# EAGLE design Esquematico (EAGLE 9.6.2)
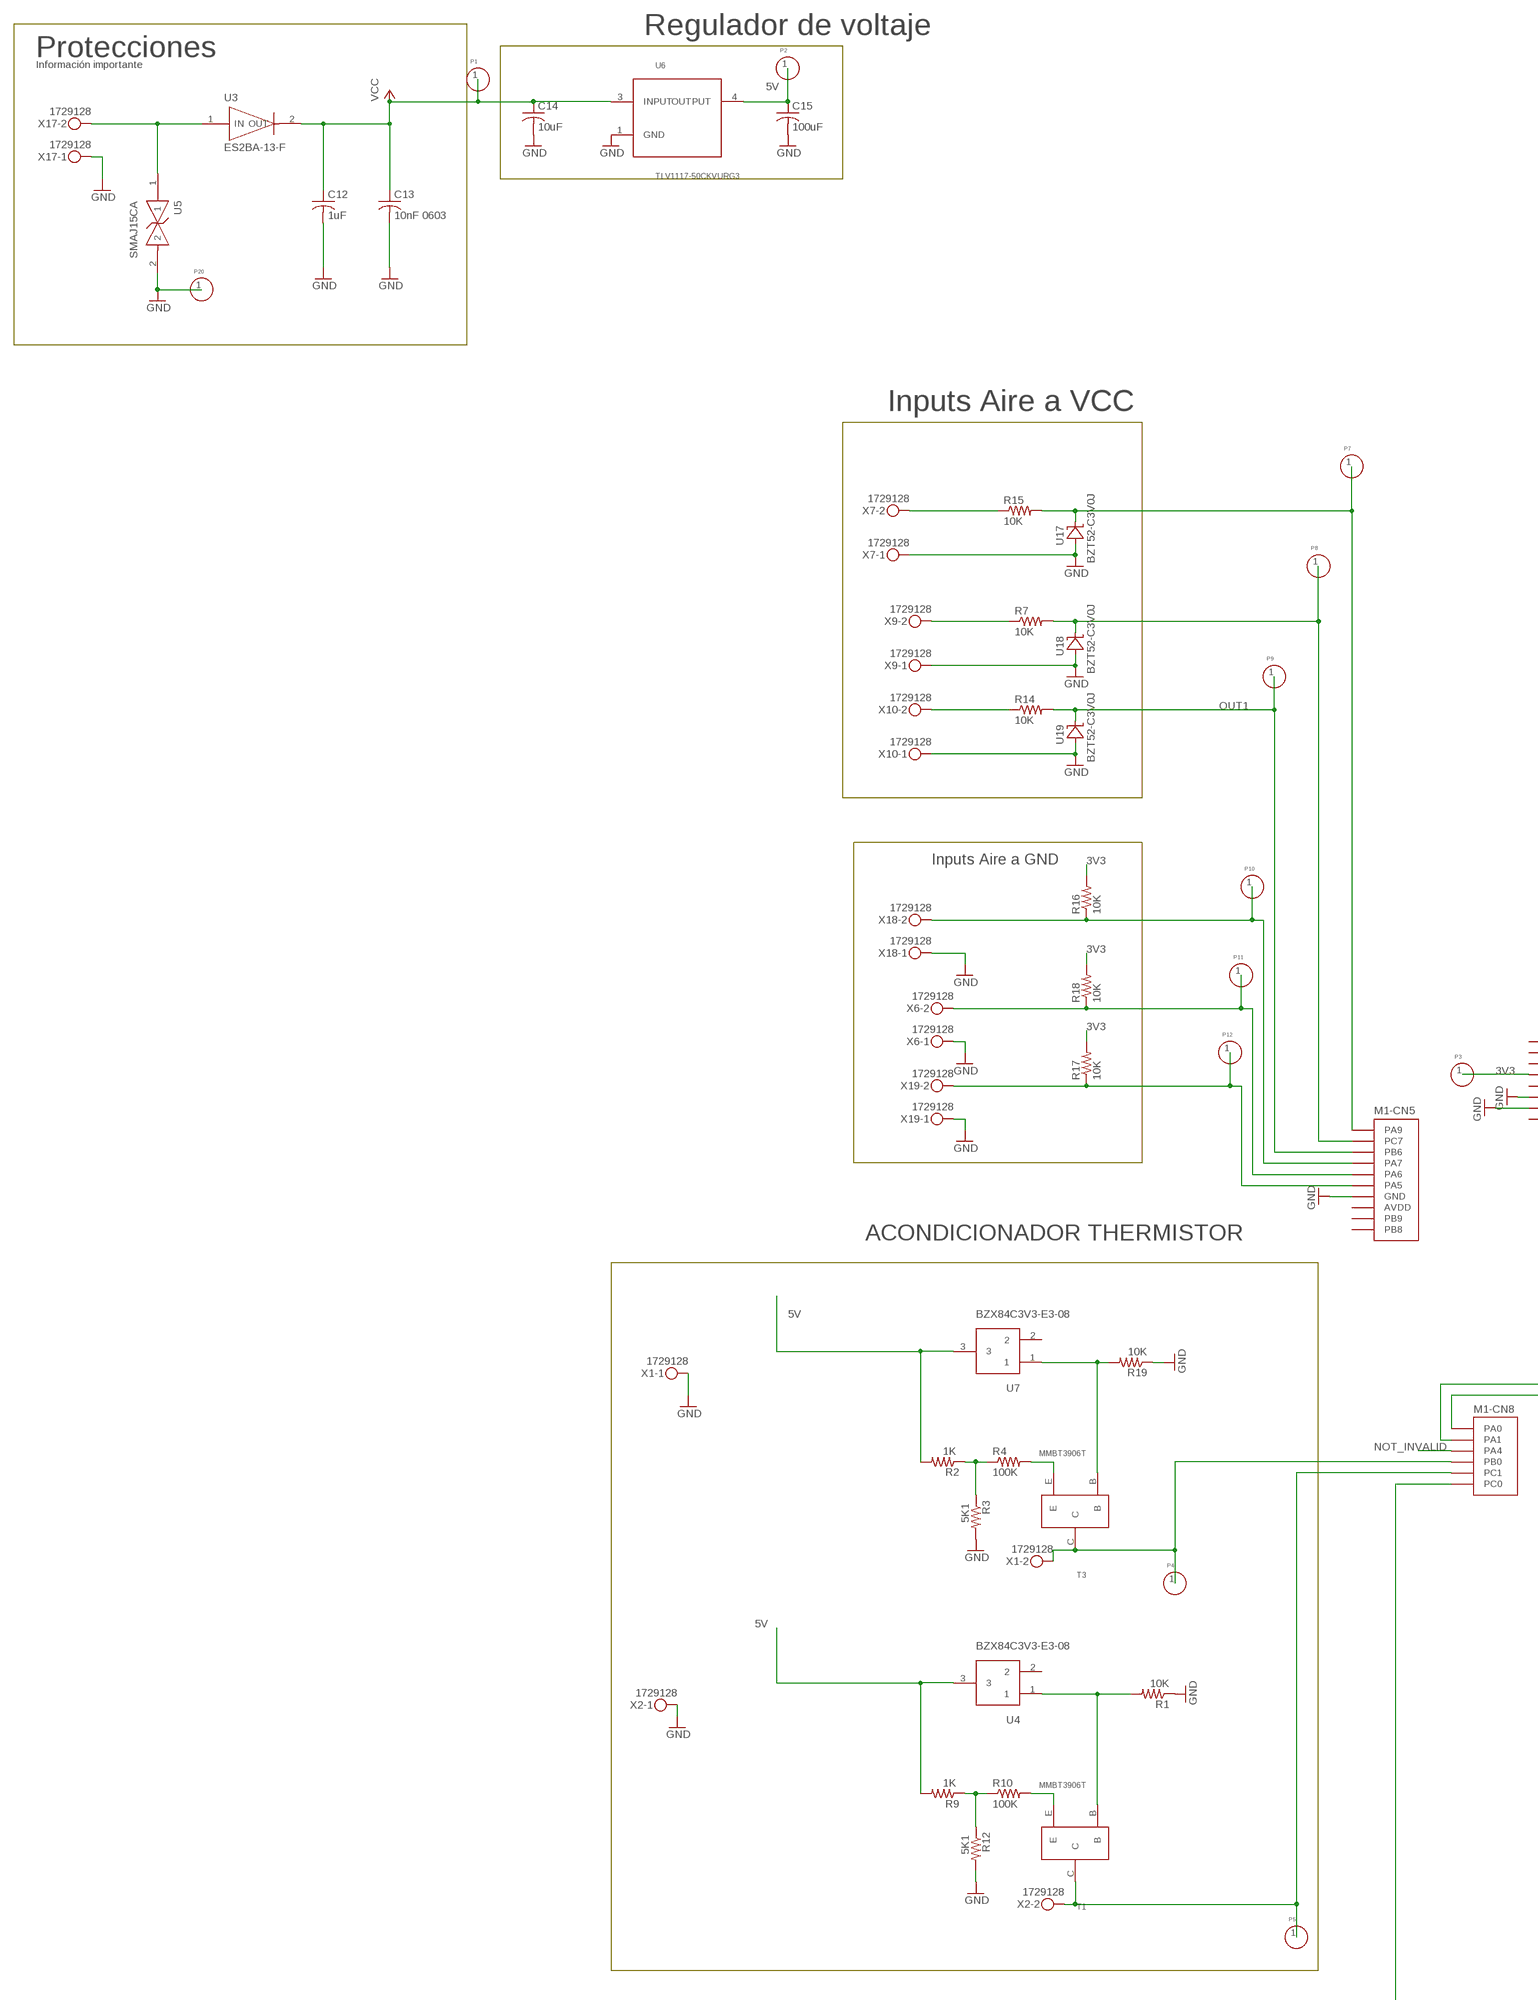
[diagram p0: schematic, sheet 1, part 1 of 3]
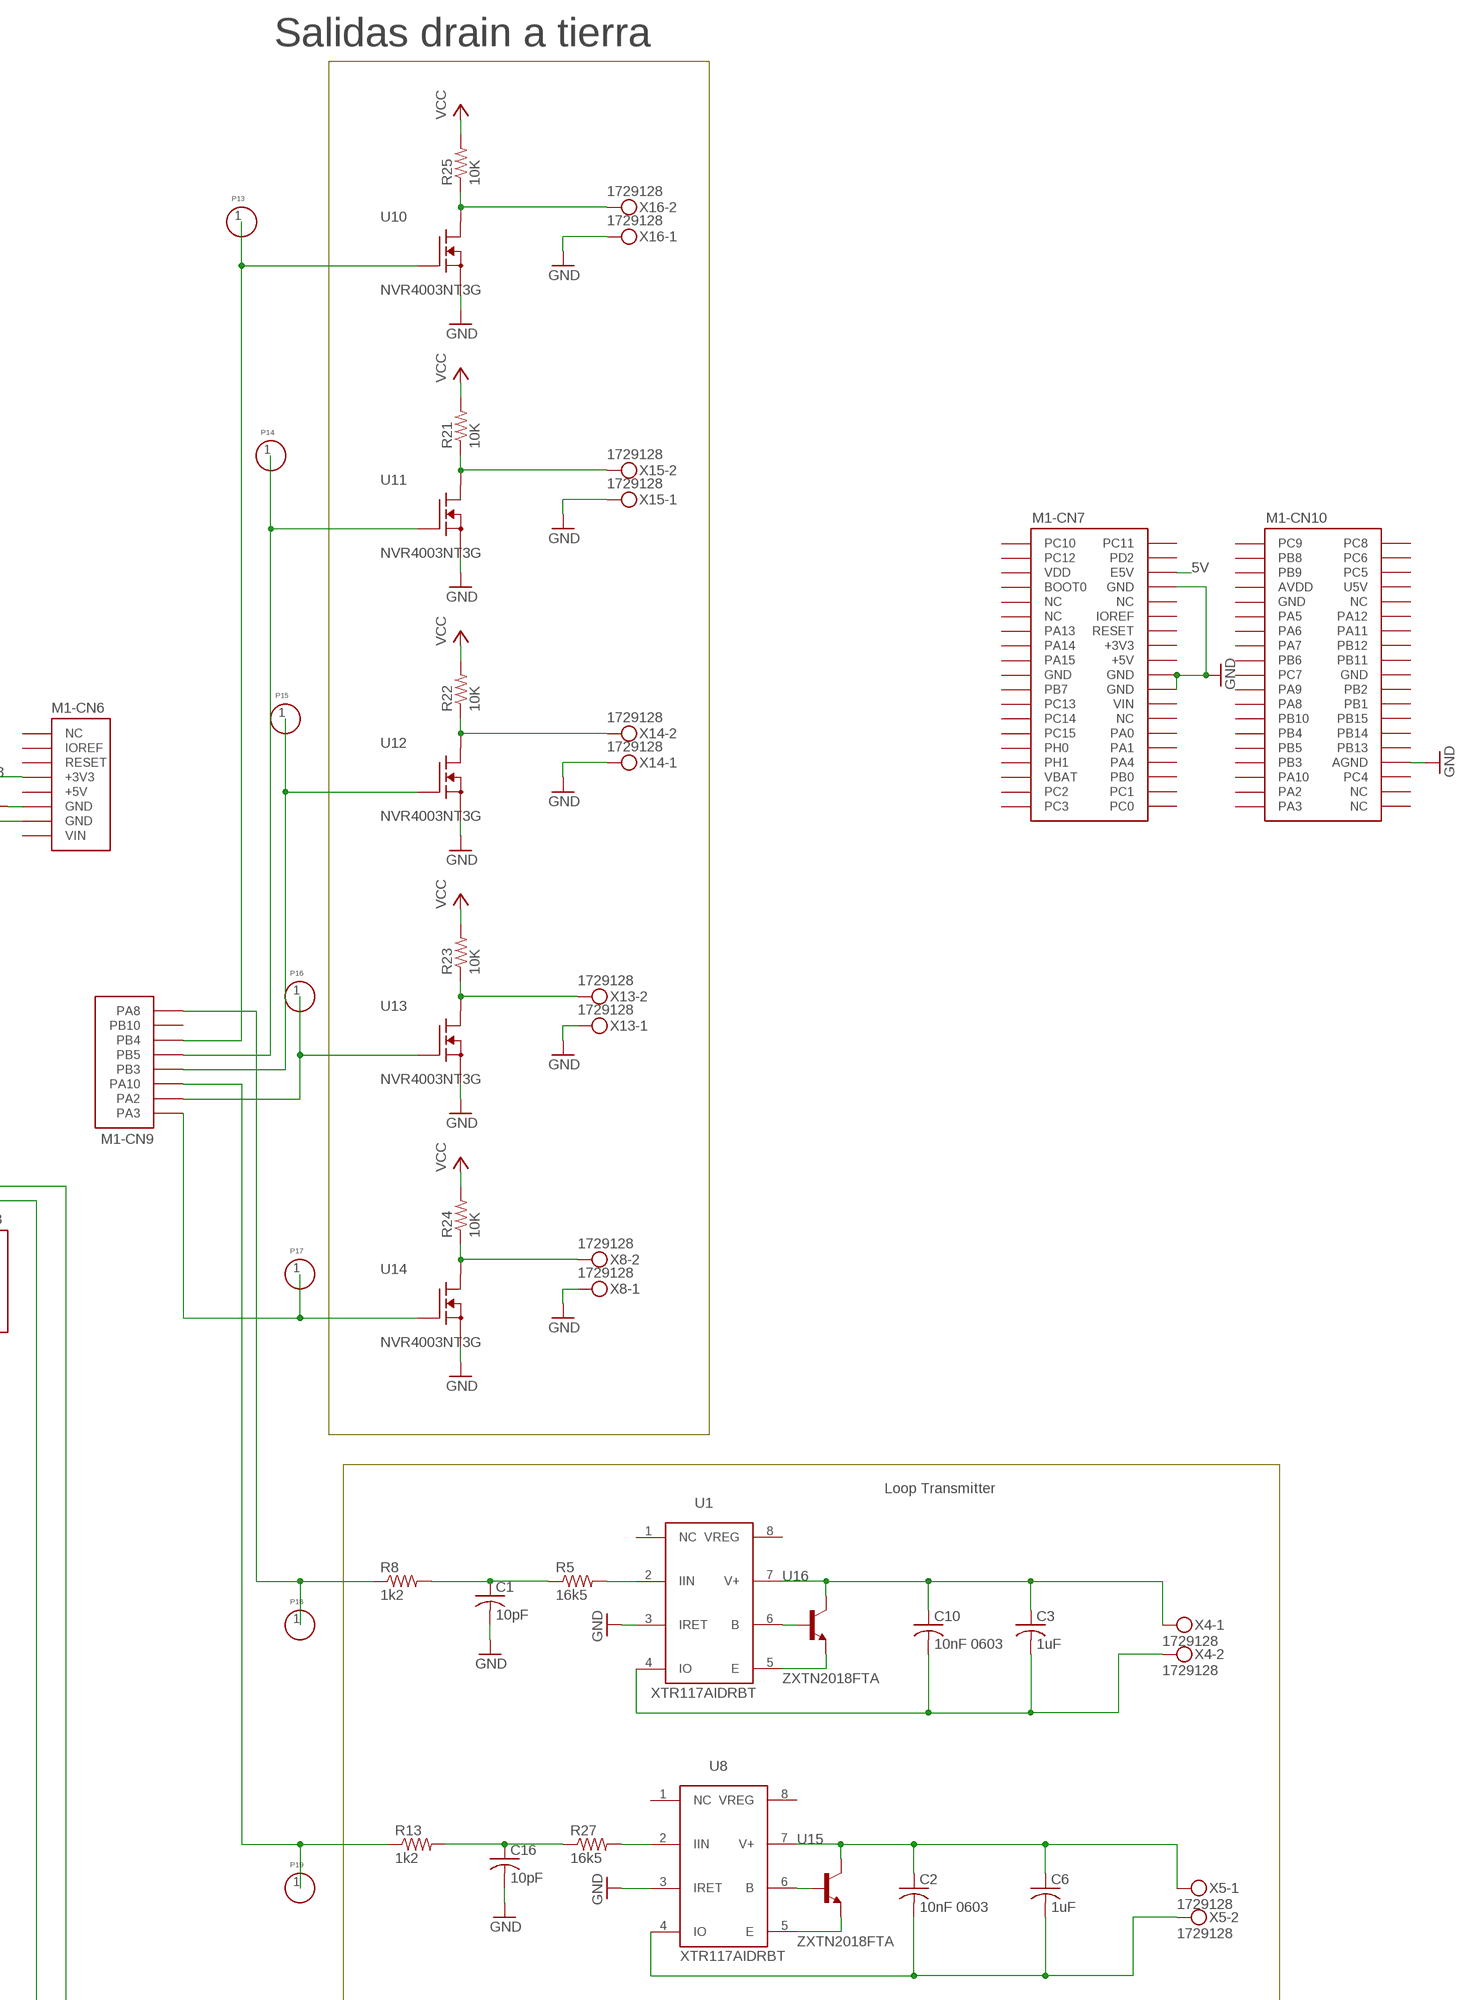
[diagram p1: schematic, sheet 1, part 2 of 3]
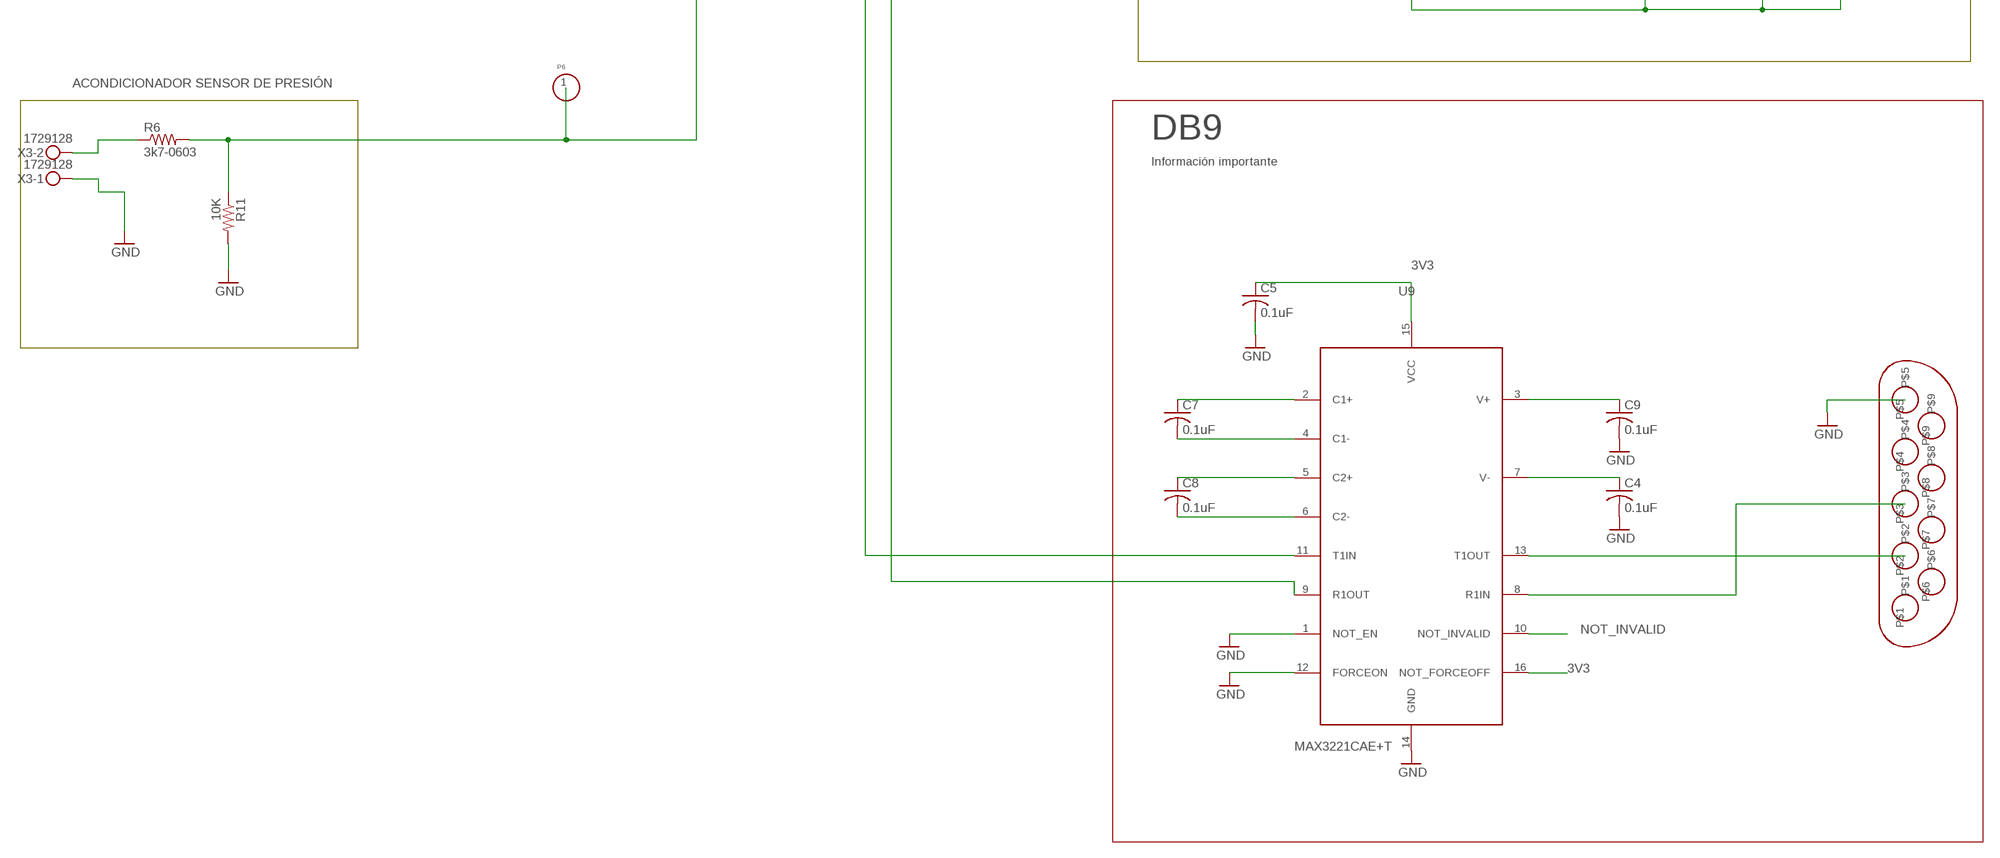
[diagram p2: schematic, sheet 1, part 3 of 3]

## Parts
C1  10pF  C-USC0805  [C0805]
C2  10nF 0603  C-USC0603  [C0603]
C3  1uF  C-USC0805  [C0805]
C4  0.1uF  C-USC0805  [C0805]
C5  0.1uF  C-USC0805  [C0805]
C6  1uF  C-USC0805  [C0805]
C7  0.1uF  C-USC0805  [C0805]
C8  0.1uF  C-USC0805  [C0805]
C9  0.1uF  C-USC0805  [C0805]
C10  10nF 0603  C-USC0603  [C0603]
C12  1uF  C-USC0805  [C0805]
C13  10nF 0603  C-USC0603  [C0603]
C14  10uF  C-USC0805  [C0805]
C15  100uF  C-USC0805  [C0805]
C16  10pF  C-USC0805  [C0805]
M1  NUCLEO-L452RE  [NUCLEO-64]
P1  TESTPOINT  [TESTPOINT]
P2  TESTPOINT  [TESTPOINT]
P3  TESTPOINT  [TESTPOINT]
P4  TESTPOINT  [TESTPOINT]
P5  TESTPOINT  [TESTPOINT]
P6  TESTPOINT  [TESTPOINT]
P7  TESTPOINT  [TESTPOINT]
P8  TESTPOINT  [TESTPOINT]
P9  TESTPOINT  [TESTPOINT]
P10  TESTPOINT  [TESTPOINT]
P11  TESTPOINT  [TESTPOINT]
P12  TESTPOINT  [TESTPOINT]
P13  TESTPOINT  [TESTPOINT]
P14  TESTPOINT  [TESTPOINT]
P15  TESTPOINT  [TESTPOINT]
P16  TESTPOINT  [TESTPOINT]
P17  TESTPOINT  [TESTPOINT]
P18  TESTPOINT  [TESTPOINT]
P19  TESTPOINT  [TESTPOINT]
P20  TESTPOINT  [TESTPOINT]
R1  10K  R-US_R0805  [R0805]
R2  1K  R-US_R0805  [R0805]
R3  5K1  R-US_R0805  [R0805]
R4  100K  R-US_R0805  [R0805]
R5  16k5  R-US_R0805  [R0805]
R6  3k7-0603  R-US_R0603  [R0603]
R7  10K  R-US_R0805  [R0805]
R8  1k2  R-US_R0805  [R0805]
R9  1K  R-US_R0805  [R0805]
R10  100K  R-US_R0805  [R0805]
R11  10K  R-US_R0805  [R0805]
R12  5K1  R-US_R0805  [R0805]
R13  1k2  R-US_R0805  [R0805]
R14  10K  R-US_R0805  [R0805]
R15  10K  R-US_R0805  [R0805]
R16  10K  R-US_R0805  [R0805]
R17  10K  R-US_R0805  [R0805]
R18  10K  R-US_R0805  [R0805]
R19  10K  R-US_R0805  [R0805]
R21  10K  R-US_R0805  [R0805]
R22  10K  R-US_R0805  [R0805]
R23  10K  R-US_R0805  [R0805]
R24  10K  R-US_R0805  [R0805]
R25  10K  R-US_R0805  [R0805]
R27  16k5  R-US_R0805  [R0805]
T1  MMBT3906T  [SOT-523]
T3  MMBT3906T  [SOT-523]
U1  XTR117AIDRBT  XTR117AIDRBT-TI  [8-SON]
U2  D09P33E4GX00LF  [JEDEC]
U3  ES2BA-13-F  [SMA]
U4  BZX84C3V3-E3-08  BZX84C3V3-E3-08_VISHAY  [SOT-23-3]
U5  SMAJ15CA  [DO-214AC(SMA)]
U6  TLV1117-50CKVURG3  [KVU(TO-252)]
U7  BZX84C3V3-E3-08  BZX84C3V3-E3-08_VISHAY  [SOT-23-3]
U8  XTR117AIDRBT  XTR117AIDRBT-TI  [8-SON]
U9  MAX3221CAE+T  MAX3221CAE+T-AD  [16-SSOP]
U10  NVR4003NT3G  NVR4003NT3-ONSEMI  [SOT-23-3]
U11  NVR4003NT3G  NVR4003NT3-ONSEMI  [SOT-23-3]
U12  NVR4003NT3G  NVR4003NT3-ONSEMI  [SOT-23-3]
U13  NVR4003NT3G  NVR4003NT3-ONSEMI  [SOT-23-3]
U14  NVR4003NT3G  NVR4003NT3-ONSEMI  [SOT-23-3]
U15  ZXTN2018FTA  [SOT23-EBC]
U16  ZXTN2018FTA  [SOT23-EBC]
U17  BZT52-C3V0J  BZT52-C3V0J-NEXPERIA  [BZT52-C3V0J-NEXPERIA]
U18  BZT52-C3V0J  BZT52-C3V0J-NEXPERIA  [BZT52-C3V0J-NEXPERIA]
U19  BZT52-C3V0J  BZT52-C3V0J-NEXPERIA  [BZT52-C3V0J-NEXPERIA]
X1  1729128  MKDSN1,5/2-5,08  [MKDSN1,5/2-5,08]
X2  1729128  MKDSN1,5/2-5,08  [MKDSN1,5/2-5,08]
X3  1729128  MKDSN1,5/2-5,08  [MKDSN1,5/2-5,08]
X4  1729128  MKDSN1,5/2-5,08  [MKDSN1,5/2-5,08]
X5  1729128  MKDSN1,5/2-5,08  [MKDSN1,5/2-5,08]
X6  1729128  MKDSN1,5/2-5,08  [MKDSN1,5/2-5,08]
X7  1729128  MKDSN1,5/2-5,08  [MKDSN1,5/2-5,08]
X8  1729128  MKDSN1,5/2-5,08  [MKDSN1,5/2-5,08]
X9  1729128  MKDSN1,5/2-5,08  [MKDSN1,5/2-5,08]
X10  1729128  MKDSN1,5/2-5,08  [MKDSN1,5/2-5,08]
X13  1729128  MKDSN1,5/2-5,08  [MKDSN1,5/2-5,08]
X14  1729128  MKDSN1,5/2-5,08  [MKDSN1,5/2-5,08]
X15  1729128  MKDSN1,5/2-5,08  [MKDSN1,5/2-5,08]
X16  1729128  MKDSN1,5/2-5,08  [MKDSN1,5/2-5,08]
X17  1729128  MKDSN1,5/2-5,08  [MKDSN1,5/2-5,08]
X18  1729128  MKDSN1,5/2-5,08  [MKDSN1,5/2-5,08]
X19  1729128  MKDSN1,5/2-5,08  [MKDSN1,5/2-5,08]

## Nets
3V3: C5.1 M1.CN6-4(-CN6:+3V3) P3.1 R16.2 R17.2 R18.2 U9.15(VCC) U9.16(NOT_FORCEOFF)
5V: C15.1 M1.CN7-6(-CN7:E5V) P2.1 R2.2 R9.2 U4.3 U6.4(OUTPUT) U7.3
GND: C1.2 C4.2 C5.2 C9.2 C12.2 C13.2 C14.2 C15.2 C16.2 M1.CN5-7(-CN5:GND) M1.CN6-6(-CN6:GND) M1.CN6-7(-CN6:GND) M1.CN7-19(-CN7:GND) M1.CN7-20(-CN7:GND) M1.CN7-22(-CN7:GND) M1.CN10-32(-CN10:AGND) P20.1 R1.1 R3.2 R11.2 R12.2 R19.1 U1.3(IRET) U2.P$5 U5.2 U6.1(GND) U8.3(IRET) U9.1(NOT_EN) U9.12(FORCEON) U9.14(GND) U10.2(SOURCE) U11.2(SOURCE) U12.2(SOURCE) U13.2(SOURCE) U14.2(SOURCE) U17.1(ANODE) U18.1(ANODE) U19.1(ANODE) X1.1 X2.1 X3.1 X6.1 X7.1 X8.1 X9.1 X10.1 X13.1 X14.1 X15.1 X16.1 X17.1 X18.1 X19.1
N$1: R19.2 T3.B U7.1
N$2: R2.1 R3.1 R4.1
N$3: R4.2 T3.E
N$4: M1.CN9-8(-CN9:PA8) P18.1 R8.1
N$5: M1.CN8-6(-CN8:PC0) P6.1 R6.2 R11.1
N$6: R6.1 X3.2
N$7: C1.1 R5.1 R8.2
N$8: R5.2 U1.2(IIN)
N$10: C16.1 R13.2 R27.1
N$11: C3.2 C10.2 U1.4(IO) X4.2
N$12: U1.6(B) U16.B
N$13: U1.5(E) U16.E
N$14: R1.2 T1.B U4.1
N$15: R9.1 R10.1 R12.1
N$16: R10.2 T1.E
N$17: M1.CN8-5(-CN8:PC1) P5.1 T1.C X2.2
N$18: C3.1 C10.1 U1.7(V+) U16.C X4.1
N$19: R27.2 U8.2(IIN)
N$21: C2.2 C6.2 U8.4(IO) X5.2
N$22: U8.6(B) U15.B
N$23: U8.5(E) U15.E
N$24: C2.1 C6.1 U8.7(V+) U15.C X5.1
N$25: R15.1 X7.2
N$26: M1.CN5-1(-CN5:PA9) P7.1 R15.2 U17.2(CATODE)
N$27: M1.CN5-4(-CN5:PA7) P10.1 R16.1 X18.2
N$28: R7.1 X9.2
N$29: M1.CN5-2(-CN5:PC7) P8.1 R7.2 U18.2(CATODE)
N$30: R14.1 X10.2
N$32: M1.CN5-5(-CN5:PA6) P11.1 R18.1 X6.2
N$33: M1.CN5-6(-CN5:PA5) P12.1 R17.1 X19.2
N$34: R21.1 U11.3(DRAIN) X15.2
N$35: M1.CN9-5(-CN9:PB5) P14.1 U11.1(GATE)
N$36: R22.1 U12.3(DRAIN) X14.2
N$37: M1.CN9-4(-CN9:PB3) P15.1 U12.1(GATE)
N$38: R23.1 U13.3(DRAIN) X13.2
N$39: M1.CN9-2(-CN9:PA2) P16.1 U13.1(GATE)
N$40: R24.1 U14.3(DRAIN) X8.2
N$41: M1.CN9-1(-CN9:PA3) P17.1 U14.1(GATE)
N$42: R25.1 U10.3(DRAIN) X16.2
N$43: M1.CN9-6(-CN9:PB4) P13.1 U10.1(GATE)
N$44: M1.CN9-3(-CN9:PA10) P19.1 R13.1
N$45: M1.CN8-4(-CN8:PB0) P4.1 T3.C X1.2
N$46: C4.1 U9.7(V-)
N$47: C9.1 U9.3(V+)
N$48: C7.1 U9.2(C1+)
N$49: C7.2 U9.4(C1-)
N$50: C8.1 U9.5(C2+)
N$51: C8.2 U9.6(C2-)
N$52: U2.P$2 U9.13(T1OUT)
N$53: U2.P$3 U9.8(R1IN)
N$56: U3.1(IN) U5.1 X17.2
N$57: M1.CN8-1(-CN8:PA0) U9.11(T1IN)
N$58: M1.CN8-2(-CN8:PA1) U9.9(R1OUT)
NOT_INVALID: M1.CN8-3(-CN8:PA4) U9.10(NOT_INVALID)
OUT1: M1.CN5-3(-CN5:PB6) P9.1 R14.2 U19.2(CATODE)
VCC: C12.1 C13.1 C14.1 P1.1 R21.2 R22.2 R23.2 R24.2 R25.2 U3.2(OUT) U6.3(INPUT)
Unconnected: M1.CN5-9(-CN5:PB9) M1.CN5-10(-CN5:PB8) M1.CN6-1(-CN6:NC) M1.CN6-3(-CN6:RESET) M1.CN7-1(-CN7:PC10) M1.CN7-2(-CN7:PC11) M1.CN7-3(-CN7:PC12) M1.CN7-4(-CN7:PD2) M1.CN7-7(-CN7:BOOT0) M1.CN7-9(-CN7:NC) M1.CN7-10(-CN7:NC) M1.CN7-11(-CN7:NC) M1.CN7-12(-CN7:IOREF) M1.CN7-13(-CN7:PA13) M1.CN7-14(-CN7:RESET) M1.CN7-15(-CN7:PA14) M1.CN7-17(-CN7:PA15) M1.CN7-21(-CN7:PB7) M1.CN7-23(-CN7:PC13) M1.CN7-25(-CN7:PC14) M1.CN7-26(-CN7:NC) M1.CN7-27(-CN7:PC15) M1.CN7-28(-CN7:PA0) M1.CN7-29(-CN7:PH0) M1.CN7-30(-CN7:PA1) M1.CN7-31(-CN7:PH1) M1.CN7-32(-CN7:PA4) M1.CN7-34(-CN7:PB0) M1.CN7-35(-CN7:PC2) M1.CN7-36(-CN7:PC1) M1.CN7-37(-CN7:PC3) M1.CN7-38(-CN7:PC0) M1.CN9-7(-CN9:PB10) M1.CN10-1(-CN10:PC9) M1.CN10-2(-CN10:PC8) M1.CN10-3(-CN10:PB8) M1.CN10-4(-CN10:PC6) M1.CN10-5(-CN10:PB9) M1.CN10-6(-CN10:PC5) M1.CN10-10(-CN10:NC) M1.CN10-11(-CN10:PA5) M1.CN10-12(-CN10:PA12) M1.CN10-13(-CN10:PA6) M1.CN10-14(-CN10:PA11) M1.CN10-15(-CN10:PA7) M1.CN10-16(-CN10:PB12) M1.CN10-17(-CN10:PB6) M1.CN10-18(-CN10:PB11) M1.CN10-19(-CN10:PC7) M1.CN10-21(-CN10:PA9) M1.CN10-22(-CN10:PB2) M1.CN10-23(-CN10:PA8) M1.CN10-24(-CN10:PB1) M1.CN10-25(-CN10:PB10) M1.CN10-26(-CN10:PB15) M1.CN10-27(-CN10:PB4) M1.CN10-28(-CN10:PB14) M1.CN10-29(-CN10:PB5) M1.CN10-30(-CN10:PB13) M1.CN10-31(-CN10:PB3) M1.CN10-33(-CN10:PA10) M1.CN10-34(-CN10:PC4) M1.CN10-35(-CN10:PA2) M1.CN10-36(-CN10:NC) M1.CN10-37(-CN10:PA3) M1.CN10-38(-CN10:NC) U1.1(NC) U1.8(VREG) U2.P$1 U2.P$4 U2.P$6 U2.P$7 U2.P$8 U2.P$9 U4.2 U7.2 U8.1(NC) U8.8(VREG)

## Notes on the sheet
- Regulador de voltaje
- Protecciones
- Información importante
- Inputs Aire a VCC
- Salidas drain a tierra
- Inputs Aire a GND
- ACONDICIONADOR THERMISTOR
- Loop Transmitter
- ACONDICIONADOR SENSOR DE PRESIÓN
- DB9
- Información importante

## Power pins joined to a net without a drawn wire
+3V3: M1.CN7-16(-CN7:+3V3)
+5V: M1.CN6-5(-CN6:+5V) M1.CN7-18(-CN7:+5V)
AVDD: M1.CN5-8(-CN5:AVDD) M1.CN10-7(-CN10:AVDD)
GND: M1.CN7-8(-CN7:GND) M1.CN10-9(-CN10:GND) M1.CN10-20(-CN10:GND)
IOREF: M1.CN6-2(-CN6:IOREF)
U5V: M1.CN10-8(-CN10:U5V)
VBAT: M1.CN7-33(-CN7:VBAT)
VDD: M1.CN7-5(-CN7:VDD)
VIN: M1.CN6-8(-CN6:VIN) M1.CN7-24(-CN7:VIN)

## Library data of the parts
C1 C16 = rcl:C-US: CAPACITOR, American symbol; PARTNO: 0805D100J101KHT; SPICEPREFIX: C
C2 C10 C13 = rcl:C-US: CAPACITOR, American symbol; PARTNO: GCM188R72A103KA37D; SPICEPREFIX: C
C3 C6 C12 = rcl:C-US: CAPACITOR, American symbol; PARTNO: GCM21BR71E105KA56L; SPICEPREFIX: C
C4 C5 C7-C9 = rcl:C-US: CAPACITOR, American symbol; PARTNO: GCM21BR72A104KA37L; SPICEPREFIX: C
C14 = rcl:C-US: CAPACITOR, American symbol; PARTNO: TCTPL1C106M8R; SPICEPREFIX: C
C15 = rcl:C-US: CAPACITOR, American symbol; PARTNO: TLJP107M006R5400; SPICEPREFIX: C
M1 = NUCLEO-L452RE:NUCLEO-L452RE: No existe un outline (Layer Dimension) para esta librería. En su lugar se utilizó una referencia en tDocu. Al momento de diseñar la tarjeta, el Dimension debe ser dibujado según los requerimientos del usuario, o simplemente copiar los contenidos del tDocu en Dimensions.; PARTNO: NUCLEO-L452RE
P1-P20 = TESTPOINT:TESTPOINT
R1 R7 R11 R14-R19 R21-R25 = rcl:R-US_: RESISTOR, American symbol; PARTNO: RK73G2ATTD1002F; SPICEPREFIX: R
R2 R9 = rcl:R-US_: RESISTOR, American symbol; PARTNO: AC0805FR-101KL; SPICEPREFIX: R
R3 R12 = rcl:R-US_: RESISTOR, American symbol; PARTNO: ESR10EZPJ512; SPICEPREFIX: R
R4 R10 = rcl:R-US_: RESISTOR, American symbol; PARTNO: AT0805FRE07100KL; SPICEPREFIX: R
R5 R27 = rcl:R-US_: RESISTOR, American symbol; PARTNO: ERJ-PB6B1652V; SPICEPREFIX: R
R6 = rcl:R-US_: RESISTOR, American symbol; PARTNO: RN73H1JTTD3701B25; SPICEPREFIX: R
R8 R13 = rcl:R-US_: RESISTOR, American symbol; PARTNO: ESR10EZPF1R20; SPICEPREFIX: R
T1 T3 = MMBT3906T:MMBT3906T; PARTNO: MMBT3906T
U1 U8 = XTR117AIDRBT-TI:XTR117AIDRBT-TI; PARTNO: XTR117AIDRBT
U2 = D09P33E4GX00LF - Amphenol ICC (FCI):D09P33E4GX00LF; PARTNO: D09P33E4GX00LF
U3 = ES2BA-13-F - Diodes Incorporated:ES2BA-13-F; PARTNO: ES2BA-13-F
U4 U7 = BZX84C3V3-E3-08:BZX84C3V3-E3-08_VISHAY; PARTNO: BZX84C3V3-E3-08
U5 = SMAJ15CA - Littelfuse Inc.:SMAJ15CA; PARTNO: SMAJ15CA
U6 = TLV1117-50CKVURG3-TI:TLV1117-50CKVURG3; PARTNO: TLV1117-50CKVURG3
U9 = MAX3221CAE+T-AD:MAX3221CAE+T-AD; PARTNO: MAX3221CAE+T
U10-U14 = NVR4003NT3G-OS:NVR4003NT3-ONSEMI; PARTNO: NVR4003NT3G
U15 U16 = ZXTN2018FTA:ZXTN2018FTA; PARTNO: ZXTN2018FTA
U17-U19 = BZT52-C3V0J-NEXPERIA:BZT52-C3V0J-NEXPERIA; PARTNO: BZT52-C3V0J
X1-X10 X13-X19 = 1729128 - Phoenix Contact (Profe):MKDSN1,5/2-5,08: MKDSN 1,5/ 2-5,08 Printklemme Nennstrom: 13,5 A Nennspannung: 250 V Rastermaß: 5,08 mm Polzahl: 2 Anschlussart: Schraubanschluss Montage: Löten Anschlussrichtung Leiter/Platine: 0 ° Artikelnummer: 1729128 Source: http://eshop.phoenixcontact.com .. 1729128.pdf; PARTNO: 1729128

## Board
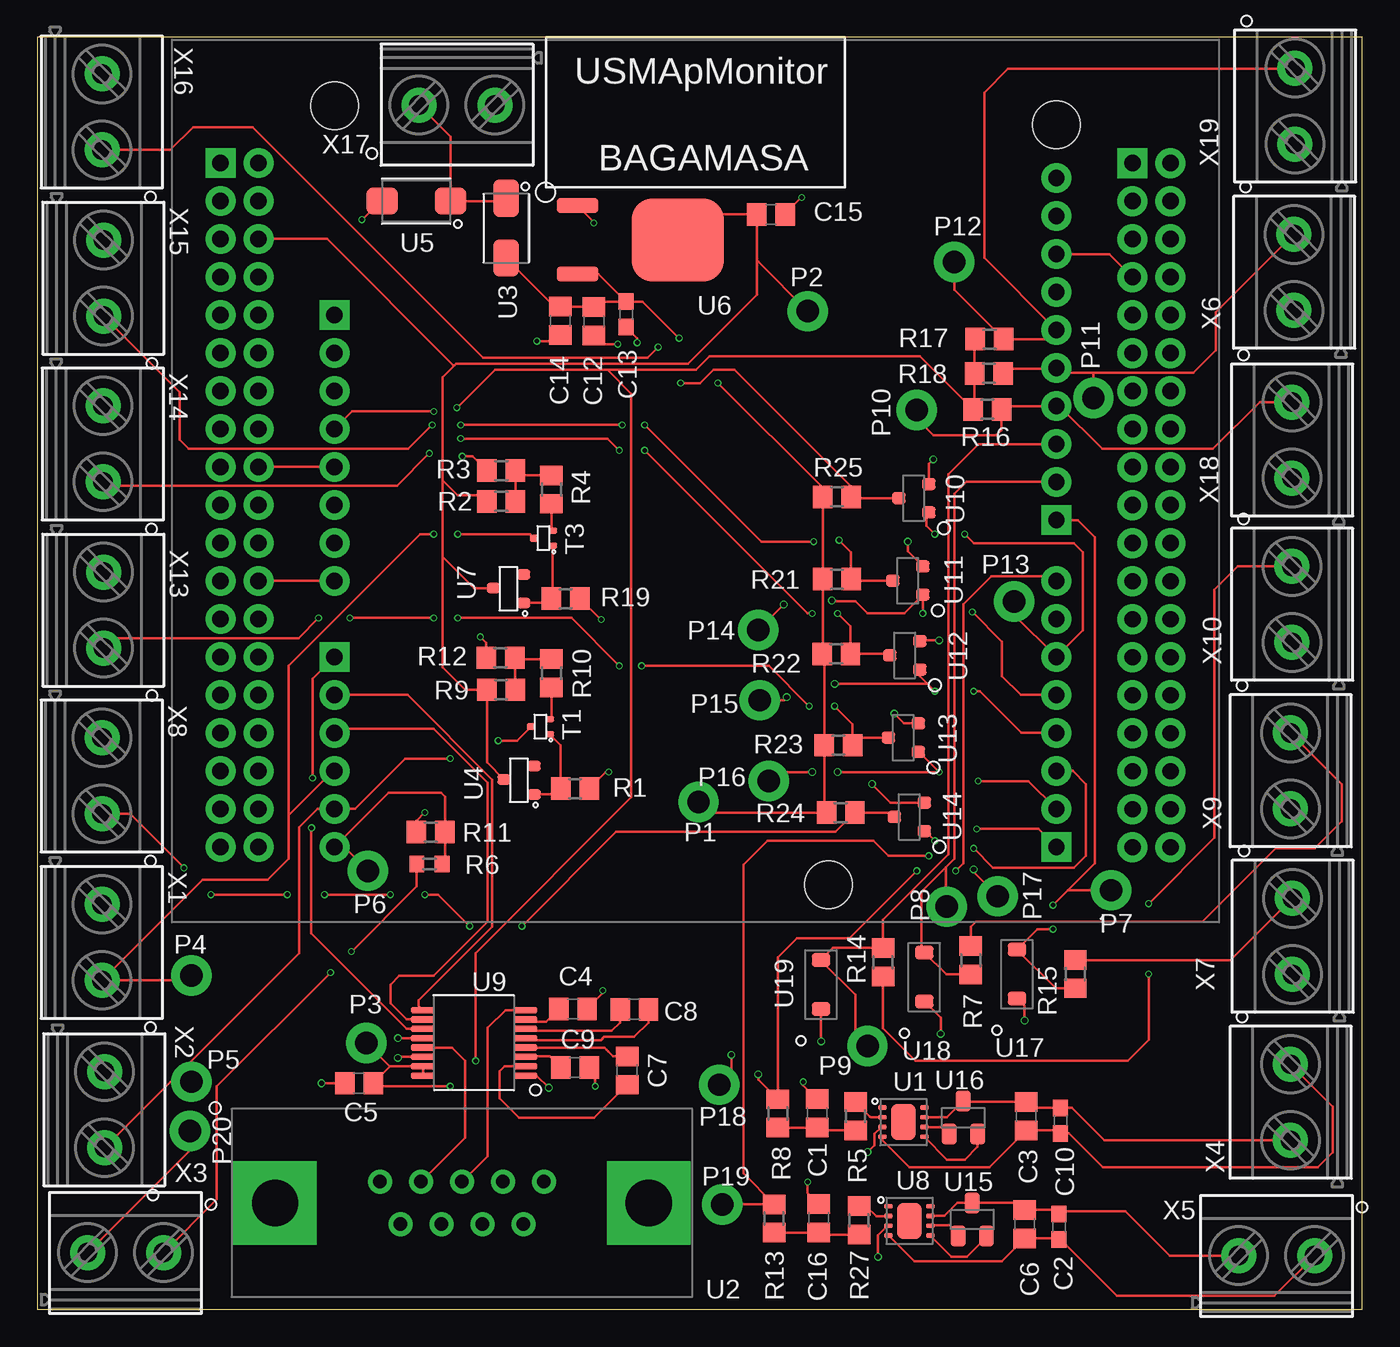
[diagram p3: board, top side]
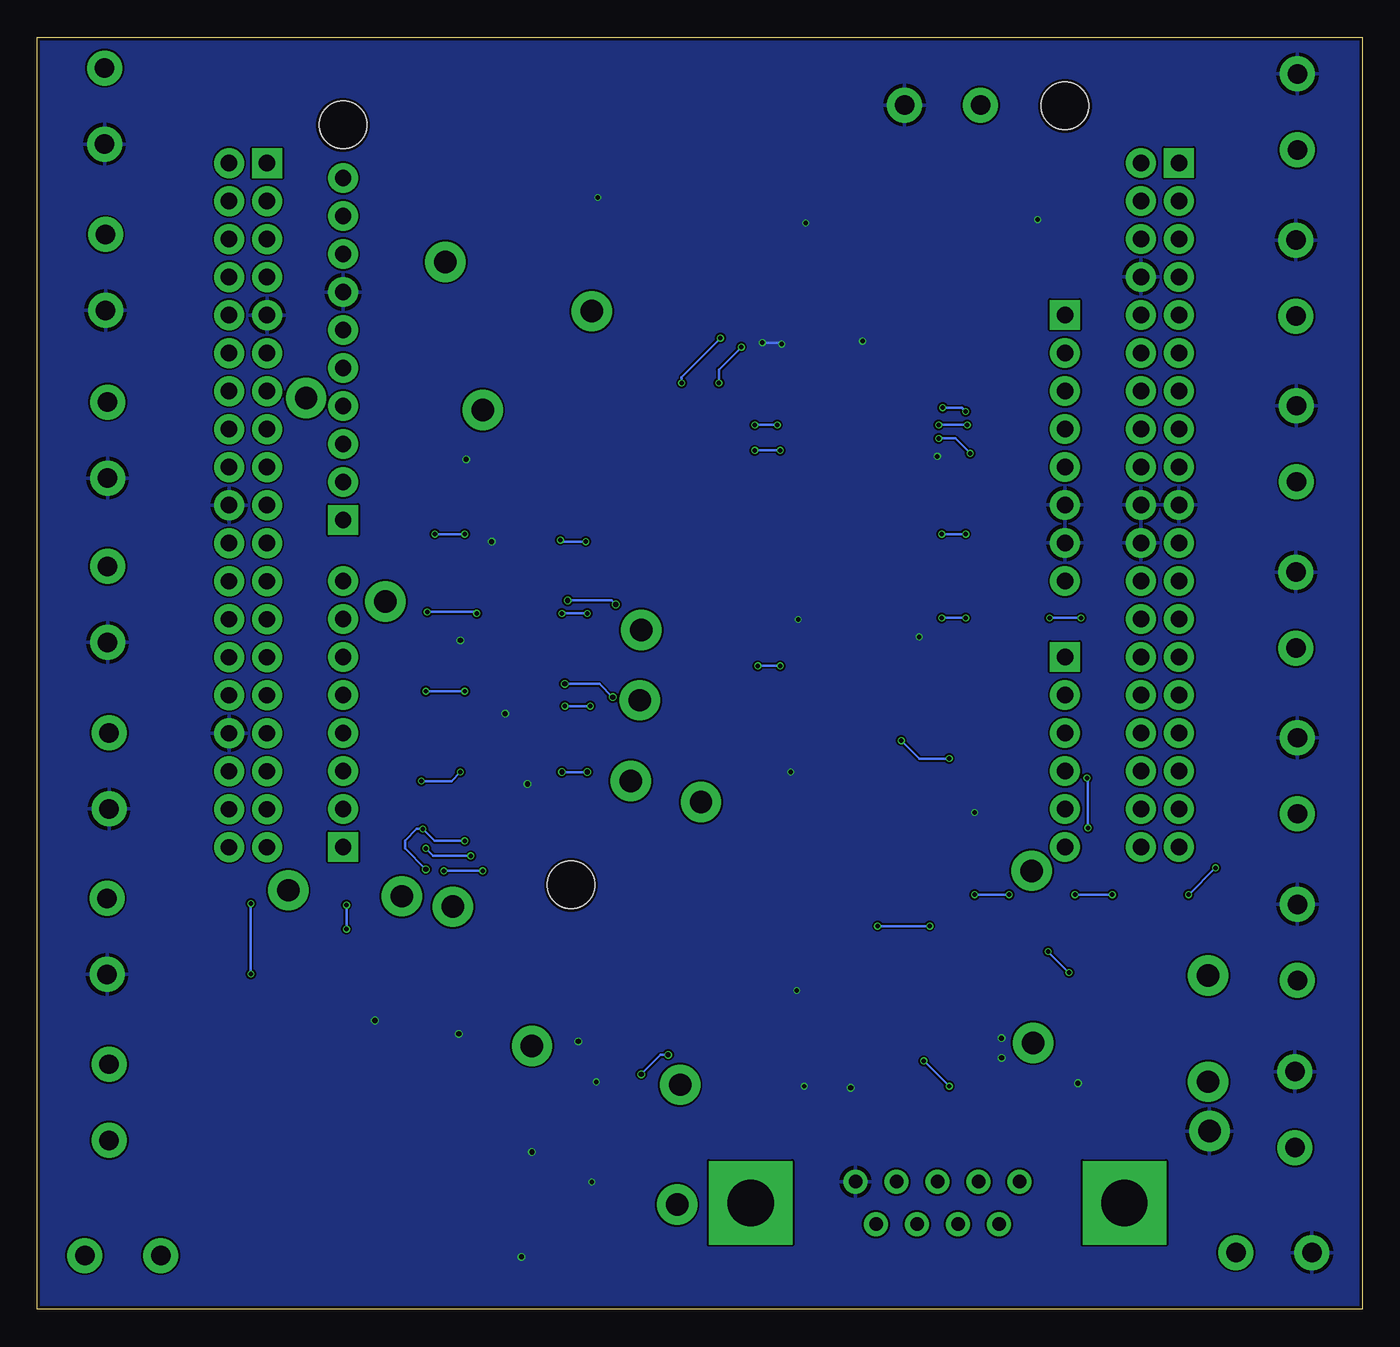
[diagram p4: board, bottom side, seen from below]

Size 88.57 x 85 mm. Coordinates in mm from the lower left corner, seen from the top.
Outline: 0,0 88.57,0 88.57,85 0,85 0,0
Copper layers (1*16): Top 0.035mm / dielectric 1.6mm / Bottom 0.035mm
Design rules "jlcpcb-2layers *": minimum track width 5mil, minimum drill 0.3mm, track to track 5mil, track to pad 5mil, pad to pad 5mil, via to via 5mil, smd to smd 5mil, copper to edge 0.2mm, drill to drill 6mil, minimum pad ring 10mil, minimum via ring 3mil, stop-mask expansion 4mil, vias tented up to drill 15mil, thermal gap 10mil

### Footprints (pad centres in the part's own frame; a part is rotated, then mirrored left to right if it is on the bottom)
C0805 = smd 1.3 x 1.5: 1 -0.95,0; 2 0.95,0
C0603 = smd 1.1 x 1: 1 -0.85,0; 2 0.85,0
NUCLEO-64 = drill 1.1 pad 1.85 square: CN5-1 59.13,24.884; CN6-1 10.87,38.6; CN7-1 3.25,48.76; CN8-1 10.87,15.74; CN9-1 59.13,3.04; CN10-1 64.21,48.735 | drill 1.1 pad 1.85: CN5-2 59.13,27.424; CN5-3 59.13,29.964; CN5-4 59.13,32.504; CN5-5 59.13,35.044; CN5-6 59.13,37.584; CN5-7 59.13,40.124; CN5-8 59.13,42.664; CN5-9 59.13,45.204; CN5-10 59.13,47.744; CN6-2 10.87,36.06; CN6-3 10.87,33.52; CN6-4 10.87,30.98; CN6-5 10.87,28.44; CN6-6 10.87,25.9; CN6-7 10.87,23.36; CN6-8 10.87,20.82; CN7-2 5.79,48.76; CN7-3 3.25,46.22; CN7-4 5.79,46.22; CN7-5 3.25,43.68; CN7-6 5.79,43.68; CN7-7 3.25,41.14; CN7-8 5.79,41.14; CN7-9 3.25,38.6; CN7-10 5.79,38.6; CN7-11 3.25,36.06; CN7-12 5.79,36.06; CN7-13 3.25,33.52; CN7-14 5.79,33.52; CN7-15 3.25,30.98; CN7-16 5.79,30.98; CN7-17 3.25,28.44; CN7-18 5.79,28.44; CN7-19 3.25,25.9; CN7-20 5.79,25.9; CN7-21 3.25,23.36; CN7-22 5.79,23.36; CN7-23 3.25,20.82; CN7-24 5.79,20.82; CN7-25 3.25,18.28; CN7-26 5.79,18.28; CN7-27 3.25,15.74; CN7-28 5.79,15.74; CN7-29 3.25,13.2; CN7-30 5.79,13.2; CN7-31 3.25,10.66; CN7-32 5.79,10.66; CN7-33 3.25,8.12; CN7-34 5.79,8.12; CN7-35 3.25,5.58; CN7-36 5.79,5.58; CN7-37 3.25,3.04; CN7-38 5.79,3.04; CN8-2 10.87,13.2; CN8-3 10.87,10.66; CN8-4 10.87,8.12; CN8-5 10.87,5.58; CN8-6 10.87,3.04; CN9-2 59.13,5.58; CN9-3 59.13,8.12; CN9-4 59.13,10.66; CN9-5 59.13,13.2; CN9-6 59.13,15.74; CN9-7 59.13,18.28; CN9-8 59.13,20.82; CN10-2 66.75,48.735; CN10-3 64.21,46.195; CN10-4 66.75,46.195; CN10-5 64.21,43.655; CN10-6 66.75,43.655; CN10-7 64.21,41.115; CN10-8 66.75,41.115; CN10-9 64.21,38.575; CN10-10 66.75,38.575; CN10-11 64.21,36.035; CN10-12 66.75,36.035; CN10-13 64.21,33.495; CN10-14 66.75,33.495; CN10-15 64.21,30.955; CN10-16 66.75,30.955; CN10-17 64.21,28.415; CN10-18 66.75,28.415; CN10-19 64.21,25.875; CN10-20 66.75,25.875; CN10-21 64.21,23.335; CN10-22 66.75,23.335; CN10-23 64.21,20.795; CN10-24 66.75,20.795; CN10-25 64.21,18.255; CN10-26 66.75,18.255; CN10-27 64.21,15.715; CN10-28 66.75,15.715; CN10-29 64.21,13.175; CN10-30 66.75,13.175; CN10-31 64.21,10.635; CN10-32 66.75,10.635; CN10-33 64.21,8.095; CN10-34 66.75,8.095; CN10-35 64.21,5.555; CN10-36 66.75,5.555; CN10-37 64.21,3.015; CN10-38 66.75,3.015 | hole 3.175: 59.13,51.3; 10.87,52.57; 43.89,0.5
TESTPOINT = drill 1.5: 1 0,0
R0805 = smd 1.3 x 1.5: 1 -0.95,0; 2 0.95,0
R0603 = smd 1 x 1.1: 1 -0.85,0; 2 0.85,0
SOT-523 = smd 0.4 x 0.6: B -0.5,-0.62; E 0.5,-0.62 | smd 0.5 x 0.6: C 0,0.62
8-SON = smd 0.6 x 0.3: 1 -1.4,0.975; 2 -1.4,0.325; 3 -1.4,-0.325; 4 -1.4,-0.975; 5 1.4,-0.975; 6 1.4,-0.325; 7 1.4,0.325; 8 1.4,0.975 | smd 1.65 x 2.4: PAD 0,0
JEDEC = drill 0.9: P$1 -5.48,1.42; P$2 -2.74,1.42; P$3 0,1.42; P$4 2.74,1.42; P$5 5.48,1.42; P$6 -4.11,-1.42; P$7 -1.37,-1.42; P$8 1.37,-1.42; P$9 4.11,-1.42 | drill 3.1 square: P$10 12.495,0; P$11 -12.495,0
SMA = smd 2.5 x 1.7: 1 -2,0; 2 2,0
SOT-23-3 = smd 0.7 x 0.9: 1 -1,-1; 2 0.9,-1; 3 0,1
DO-214AC(SMA) = smd 2.083 x 1.778: 1 -2.286,0; 2 2.286,0
KVU(TO-252) = smd 2.75 x 1: 1 -2.29,2.29; 3 -2.29,-2.29 | smd 6.15 x 5.55: 4 4.41,0
16-SSOP = smd 1.63 x 0.42: 1 -3.425,2.188; 2 -3.425,1.562; 3 -3.425,0.938; 4 -3.425,0.312; 5 -3.425,-0.312; 6 -3.425,-0.938; 7 -3.425,-1.562; 8 -3.425,-2.188; 9 3.425,-2.188; 10 3.425,-1.562; 11 3.425,-0.938; 12 3.425,-0.312; 13 3.425,0.312; 14 3.425,0.938; 15 3.425,1.562; 16 3.425,2.188
SOT-23-3' = smd 0.8 x 0.9: 1 -0.95,-1; 2 0.95,-1; 3 0,1
SOT23-EBC = smd 1 x 1.4: B -0.95,-1.1; C 0,1.1; E 0.95,-1.1
BZT52-C3V0J-NEXPERIA = smd 0.91 x 1.22: 1 -1.635,0; 2 1.635,0
MKDSN1,5/2-5,08 = drill 1.3 pad 2: 1 -2.561,0.025; 2 2.519,0.025

### Placement (x,y rotation side)
C1  52.14,13.09 90 top
C2  68.3,5.5 270 top
C3  66.11,12.9 270 top
C4  35.8,20.07 0 top
C5  21.5,15.1 180 top
C6  66.01,5.68 270 top
C7  39.43,15.95 90 top
C8  39.91,20.04 180 top
C9  35.94,16.16 0 top
C10  68.4,12.6 270 top
C12  37.21,66.02 270 top
C13  39.36,66.49 270 top
C14  34.96,66.06 270 top
C15  49.05,73.17 0 top
C16  52.24,6.09 90 top
M1  9,27.86 0 top
P1  44.2,33.9 0 top
P2  51.5,66.7 0 top
P3  22,17.8 0 top
P4  10.3,22.3 0 top
P5  10.3,15.2 0 top
P6  22.1,29.3 0 top
P7  71.8,28 0 top
P8  60.8,26.9 0 top
P9  55.5,17.6 0 top
P10  58.8,60.1 0 top
P11  70.6,60.9 0 top
P12  61.3,70 0 top
P13  65.3,47.3 0 top
P14  48.2,45.4 0 top
P15  48.3,40.7 0 top
P16  48.9,35.3 0 top
P17  64.2,27.6 0 top
P18  45.6,15 0 top
P19  45.8,7 0 top
P20  10.2,11.9 0 top
R1  35.94,34.79 180 top
R2  31.01,53.99 180 top
R3  31.01,56.04 180 top
R4  34.37,54.78 270 top
R5  54.7,12.9 90 top
R6  26.22,29.76 0 top
R7  62.41,23.32 270 top
R8  49.51,13.08 270 top
R9  31,41.4 180 top
R10  34.37,42.5 270 top
R11  26.3,31.89 180 top
R12  30.96,43.54 180 top
R13  49.26,6.06 270 top
R14  56.54,23.19 90 top
R15  69.4,22.4 270 top
R16  63.51,60.14 180 top
R17  63.66,64.84 180 top
R18  63.61,62.54 180 top
R19  35.31,47.49 180 top
R21  53.46,48.79 180 top
R22  53.41,43.79 180 top
R23  53.56,37.69 180 top
R24  53.71,33.19 180 top
R25  53.46,54.29 180 top
R27  54.94,5.94 90 top
T1  33.63,38.94 90 top
T3  33.83,51.53 90 top
U1  57.9,12.5 0 top
U2  28.39,7.1 0 top
U3  31.34,72.25 270 top
U4  32.2,35.4 90 top
U5  25.33,74.06 180 top
U6  38.41,71.47 0 top
U7  31.5,48.2 90 top
U8  58.3,5.9 0 top
U9  29.2,17.8 180 top
U10  NVR4003NT3G  [SOT-23-3']  58.6,54.2 90 top
U11  NVR4003NT3G  [SOT-23-3']  58.2,48.7 90 top
U12  NVR4003NT3G  [SOT-23-3']  58,43.7 90 top
U13  NVR4003NT3G  [SOT-23-3']  57.9,38.2 90 top
U14  NVR4003NT3G  [SOT-23-3']  58.3,32.9 90 top
U15  62.5,6 0 top
U16  61.9,12.8 0 top
U17  65.5,22.4 90 top
U18  59.3,22.2 90 top
U19  52.4,21.7 90 top
X1  4.3,24.5 270 top
X2  4.46,13.31 270 top
X3  5.92,3.76 0 top
X4  83.8,13.85 90 top
X5  82.88,3.56 0 top
X6  84.04,69.31 90 top
X7  83.94,24.94 90 top
X8  4.3,35.63 270 top
X9  83.8,36 90 top
X10  83.9,47.13 90 top
X13  4.4,46.7 270 top
X14  4.36,57.82 270 top
X15  4.4,68.89 270 top
X16  4.3,80 270 top
X17  28.03,80.5 180 top
X18  83.9,58.11 90 top
X19  84.1,80.43 90 top

### Tracks (layer width: path | path; a pad name or v marks a point on that pad's centre or on a via)
3V3  (via drill 0.3)
  Top 0.152: R17.2 62.66,64.79 R18.2 62.66,60.24 R16.2 59,63.7 44.93,63.7 44.02,62.79 38.11,62.79 | v28.05,60.25 30.59,62.79 38.11,62.79 | v26.5,60 21.03,60 M1.CN6-4 | v29.3,16.6 29.3,23.8 39.7,34.2 39.7,61.2 38.11,62.79 | U9.16 U9.15 23.59,16.24 | 23.59,16.24 C5.1 22.65,14.9 v27.6,14.9 | 23.59,16.24 23.56,16.24 P3.1
  Bottom 0.152: v28.05,60.25 26.75,60.25 v26.5,60 | v27.6,14.9 v29.3,16.6
5V
  Top 0.152: U6.4 44.52,73.17 C15.1 48.1,70 | 48.1,70 48.1,67.8 43.49,63.19 27.99,63.19 27.89,63.09 | M1.CN7-6 19.36,71.54 27.8,63.1 27.79,63.09 27.89,63.09 | 27.89,63.09 27.1,62.3 27.1,55.4 | 27.1,55.4 28.11,54.39 29.66,54.39 R2.2 | U7.3 29.2,48.2 27.1,50.3 | 27.1,50.3 27.1,55.4 | 27.1,50.3 27.1,42.9 28.6,41.4 R9.2 30.05,36.55 U4.3 | P2.1 48.2,70 48.1,70
+5V
  Top 0.152: M1.CN7-18 M1.CN6-5
AVDD
  Top 0.152: M1.CN5-8 71.66,70.52 M1.CN10-7
GND  (via drill 0.3, 0.35)
  Top 0.152: C15.2 50,73.2 v51.1,74.3 | C13.2 40.1,64.9 v40.1,64.6 | v38.8,64.5 37.78,64.5 C12.2 | C14.2 34.55,64.7 v33.4,64.7 | U6.1 37.2,72.68 v37.2,72.6 | R12.2 30.01,44.54 v29.61,44.94 | v37.7,46.1 37.65,46.1 R19.1 | R3.2 29.1,57 v28.4,57 | R1.1 38,35.9 v38.2,35.9 | C9.2 37.3,15.75 v37.3,14.9 | C4.2 37.8,21.12 v37.8,21.3 | R11.2 25.35,32.65 v25.9,33.2 | C1.2 51.2,14.98 v51.2,15.2 | C16.2 51.5,7.78 v51.5,8.5 | X3.1 10.2,10.63 P20.1 | U9.14 24.16,16.86 v24.1,16.8 | v55.5,10.5 55.97,10.97 55.97,11.73 56.42,12.18 U1.3 | v56.2,3.5 56.2,4.95 56.82,5.58 U8.3 | U10.2 59.6,56.5 v59.9,56.8 | U11.2 58.2,50.65 v58.2,51.3 | U12.2 59.05,44.7 v60.29,44.7 | U14.2 57.05,33.85 v55.8,35.1 | U13.2 57.95,39.15 v57.3,39.8 | U17.1 66,20.27 v66,19.3 | U18.1 60.4,19.46 v60.4,18.4 | U19.1 v52.4,17.9 | v24.11,18.11 U9.12 | v21.7,72.82 22.94,74.06 U5.2 | U9.1 33.39,15.61 v34.2,14.8 | C5.2 v19,15.1
  Bottom 0.152: v38.8,64.5 38.9,64.6 v40.1,64.6
  pour Bottom: 0.1,84.9 0.1,0.1 88.5,0.1 88.5,84.9
N$1
  Top 0.152: U7.1 34.07,47.2 R19.2 34.43,47.56 34.43,51.01 T3.B
N$2
  Top 0.152: R2.1 31.96,54.04 R3.1 32.27,55.73 R4.1
N$3
  Top 0.152: R4.2 34.37,52.11 T3.E
N$4  (via drill 0.3, 0.35)
  Top 0.152: v61.4,29.3 61.9,29.8 61.9,47.1 63.8,49 67.81,49 M1.CN9-8 | v58.8,29.3 54.3,24.8 50.8,24.8 49.51,23.51 R8.1 48.2,15.34 v48.2,15.7 | v46.4,17 46.4,15.8 P18.1
  Bottom 0.152: v58.8,29.3 v61.4,29.3 | v48.2,15.7 46.9,17 v46.4,17
N$5
  Top 0.152: R6.2 27.25,29.94 R11.1 27.25,34.25 27,34.5 23.47,34.5 M1.CN8-6 20.5,30.9 P6.1
N$6  (via drill 0.3)
  Top 0.152: X3.2 12,7.35 12,14.9 v19.6,22.5 | v21,23.9 25.37,28.27 R6.1
  Bottom 0.152: v19.6,22.5 v21,23.9
N$7
  Top 0.152: R5.1 52.33,11.95 C1.1 R8.2
N$8
  Top 0.152: R5.2 55.67,12.88 55.73,12.82 U1.2
N$10
  Top 0.152: R27.1 52.39,4.99 C16.1 52.21,5.11 R13.2
N$11
  Top 0.152: X4.2 86.6,13.54 86.6,10.5 85.6,9.5 71.22,9.5 68.97,11.75 C10.2 68.2,11.95 C3.2 63.66,9.5 58.3,9.5 56.5,11.3 U1.4
N$12
  Top 0.152: U16.B 60.48,12.18 U1.6
N$13
  Top 0.152: U1.5 60.83,10 62,10 62.85,10.85 U16.E
N$14
  Top 0.152: T1.B 34.99,37.7 R1.2 34.6,34.4 U4.1
N$15
  Top 0.152: R9.1 31.95,43.5 R12.1 32,43.45 R10.1
N$16
  Top 0.152: R10.2 34.37,39.56 T1.E
N$17  (via drill 0.3)
  Top 0.152: T1.C 32.07,38 v30.81,38 | v27.6,36.8 24.6,36.8 21.24,33.44 M1.CN8-5 18.74,33.44 17.5,32.2 17.5,23.8 X2.2 8.9,15.2 P5.1
  Bottom 0.152: v30.81,38 29.61,36.8 v27.6,36.8
N$18
  Top 0.152: X4.1 71.33,11.29 69.17,13.45 C10.1 66.51,13.45 C3.1 61.95,13.85 U16.C 60.83,12.82 U1.7
N$19
  Top 0.152: R27.2 55.41,6.89 56.1,6.2 56.88,6.2 U8.2
N$21
  Top 0.152: X5.2 82.71,0.9 72.18,0.9 68.43,4.65 C2.2 68.22,4.73 C6.2 64.48,3.2 58.62,3.2 U8.4
N$22
  Top 0.152: U8.6 59.73,5.6 61.02,5.6 61.55,5.07 U15.B
N$23
  Top 0.152: U8.5 59.7,4.9 61.1,3.5 62.15,3.5 63.45,4.8 U15.E
N$24
  Top 0.152: X5.1 75.71,3.59 72.75,6.55 68.5,6.55 C2.1 68.02,6.63 C6.1 65.54,7.1 U15.C 61.5,7.1 60.65,6.25 59.73,6.25 U8.7
N$25
  Top 0.152: X7.2 79.76,23.31 69.44,23.31 R15.1
N$26  (via drill 0.3)
  Top 0.152: v67.9,27 68.9,28 | 68.9,28 70.7,29.8 70.7,51.6 69.56,52.74 M1.CN5-1 | P7.1 68.9,28 | v67.9,25.4 66.86,25.4 U17.2 68.08,21.45 R15.2
  Bottom 0.152: v67.9,25.4 v67.9,27
N$27
  Top 0.152: P10.1 58.8,59.5 59.9,58.4 64.1,58.4 64.46,58.76 R16.1 64.68,60.36 M1.CN5-4 68.34,60.36 71.2,57.5 78.6,57.5 81.73,60.63 X18.2
N$28
  Top 0.152: R7.1 62.41,25.57 62.74,25.9 77.9,25.9 82.8,30.8 85.4,30.8 87.2,32.6 87.2,35.09 X9.2
N$29
  Top 0.152: M1.CN5-2 68.11,55.3 62.1,55.3 61.3,54.5 61.3,30.1 60.75,29.55 | R7.2 60.77,22.37 U18.2 59.1,24.04 59.1,27.9 60.75,29.55 | 60.75,29.55 60.75,26.95 P8.1
N$30  (via drill 0.3)
  Top 0.152: R14.1 56.54,18.76 58.7,16.6 72.9,16.6 74.3,18 v74.3,22.4 | v74.3,27.1 78.7,31.5 78.7,48.1 80.25,49.65 X10.2
  Bottom 0.152: v74.3,22.4 v74.3,27.1
N$32
  Top 0.152: X6.2 78.8,66.62 78.8,64.1 77.3,62.6 70.6,62.6 | 68.17,62.87 68.43,62.6 70.6,62.6 | 68.17,62.87 M1.CN5-5 | R18.1 64.89,62.87 68.17,62.87 | P11.1 70.6,62.6
N$33
  Top 0.152: X19.2 84.03,82.9 64.9,82.9 63.3,81.3 63.3,70.27 M1.CN5-6 67.53,64.84 R17.1 61.3,68.15 P12.1
N$34  (via drill 0.3)
  Top 0.152: v40.6,59.1 48.4,51.3 v51.9,51.3 | v53.6,51.4 54.41,50.59 R21.1 54.5,48.7 U11.3 | v39.09,59.1 v28.3,59.1 | X15.2 9.5,61.3 9.5,58.1 10.1,57.5 24.79,57.5 v26.39,59.1
  Bottom 0.152: v26.39,59.1 v28.3,59.1 | v40.6,59.1 v39.09,59.1 | v51.9,51.3 53.5,51.3 v53.6,51.4
N$35  (via drill 0.3, 0.35)
  Top 0.152: v53.12,47.37 53.1,47.35 53.1,47.3 54.7,47.3 55.49,46.51 57.96,46.51 U11.1 v59.2,46.51 | v49.9,47.1 P14.1 | v62.51,46.6 64.5,44.61 64.5,42.3 65.74,41.06 M1.CN9-5
  Bottom 0.152: v62.51,46.6 59.2,46.6 v59.2,46.51 | v53.12,47.37 50.17,47.37 v49.9,47.1
N$36  (via drill 0.3)
  Top 0.152: X14.2 4.64,55.04 24.04,55.04 v26.2,57.2 | v28.3,58.19 38.11,58.19 v38.9,57.4 | v40.6,57.4 51.5,46.5 v51.8,46.5 | v53.5,46.5 54.36,45.64 R22.1 56.91,43.79 U12.3
  Bottom 0.152: v26.2,57.2 27.2,58.2 v28.29,58.2 v28.3,58.19 | v38.9,57.4 v40.6,57.4 | v51.8,46.5 v53.5,46.5
N$37  (via drill 0.3, 0.35)
  Top 0.152: M1.CN9-4 65.78,38.52 63,41.3 v62.6,41.3 | v53.3,41.8 59.3,41.8 59.38,41.8 59.5,41.8 | v50.1,40.9 49.9,40.7 P15.1 | U12.1 59,42.3 59.5,41.8 | 59.5,41.8 v60,41.3
  Bottom 0.152: v62.6,41.3 v60,41.3 | v53.3,41.8 51,41.8 v50.1,40.9
N$38  (via drill 0.3)
  Top 0.152: X13.2 5.1,44.85 17.45,44.85 v18.8,46.2 | v20.9,46.2 v26.49,46.2 | v28.1,46.2 35.7,46.2 v38.9,43 | v40.4,43 48.9,43 v51.6,40.3 | v53.3,40.3 54.51,39.09 R23.1 55.02,38.2 U13.3
  Bottom 0.152: v20.9,46.2 v18.8,46.2 | v26.49,46.2 v28.1,46.2 | v38.9,43 v40.4,43 | v51.6,40.3 v53.3,40.3
N$39  (via drill 0.3, 0.35)
  Top 0.152: v62.9,35.3 66.27,35.3 M1.CN9-2 | v53.5,35.9 v60.29,35.9 58.94,37.25 U13.1 | v51.8,35.9 49.5,35.9 P16.1
  Bottom 0.152: v60.29,35.9 60.89,35.3 v62.9,35.3 | v53.5,35.9 v51.8,35.9
N$40  (via drill 0.3)
  Top 0.152: X8.2 6.19,33.11 v9.8,29.5 | v11.6,27.7 v16.7,27.7 | v19.2,27.7 v23.6,27.7 | v25.9,27.7 26.8,27.7 v28.9,25.6 | v32.4,25.6 38.7,31.9 53.37,31.9 R24.1 57.01,33.19 U14.3
  Bottom 0.152: v9.8,29.5 v11.6,27.7 | v16.7,27.7 v19.2,27.7 | v23.6,27.7 v25.9,27.7 | v28.9,25.6 v32.4,25.6
N$41  (via drill 0.3, 0.35)
  Top 0.152: M1.CN9-1 66.93,32.1 v62.8,32.1 | P17.1 62.6,29.2 v62.6,29.4 | U14.1 59.35,31.95 v60,31.3
  Bottom 0.152: v60,31.3 62,31.3 v62.8,32.1 63.2,32.1 64,31.3 64,30.8 v62.6,29.4
N$42  (via drill 0.3)
  Top 0.152: X16.2 8.88,77.48 10.4,79 14.4,79 29.8,63.6 40.8,63.6 v41.5,64.3 | v43,61.9 44.3,61.9 45.2,62.8 46.6,62.8 54.41,54.99 R25.1 | R25.1 | U10.3 54.51,54.2 R25.1
  Bottom 0.152: v41.5,64.3 43,62.8 v43,61.9
N$43  (via drill 0.3)
  Top 0.152: v62,51.8 62.6,51.2 69.3,51.2 69.9,50.6 69.9,45.37 M1.CN9-6 65.3,46.43 P13.1 | v60,51.8 59.44,52.36 59.44,53.09 U10.1
  Bottom 0.152: v62,51.8 v60,51.8
N$44  (via drill 0.3)
  Top 0.152: v59.6,30.3 56.9,30.3 55.9,31.3 48.8,31.3 47.2,29.7 47.2,9.07 R13.1 P19.1 | v62.6,30.8 63.9,29.5 69.3,29.5 70.1,30.3 70.1,35.1 69.22,35.98 M1.CN9-3
  Bottom 0.152: v62.6,30.8 62.1,30.3 v59.6,30.3
N$45  (via drill 0.3)
  Top 0.152: 16.8,33 16.8,30.1 15.4,28.7 11.04,28.7 X1.2 9.98,21.98 P4.1 | 16.8,33 19.78,35.98 M1.CN8-4 | 16.8,33 16.8,43 25.6,51.8 v26.49,51.8 | v28.1,51.8 32.94,51.8 T3.C
  Bottom 0.152: v26.49,51.8 v28.1,51.8
N$46
  Top 0.152: C4.1 34,19.22 32.77,19.22 U9.7
N$47
  Top 0.152: U9.3 32.66,16.9 34.25,16.9 C9.1
N$48
  Top 0.152: C7.1 37.23,12.8 32.2,12.8 30.9,14.1 30.9,15.9 31.24,16.24 U9.2
N$49
  Top 0.152: C7.2 38.5,16.9 38.15,17.25 38.05,17.35 37.91,17.49 U9.4
N$50
  Top 0.152: C8.1 40.86,19.16 39.9,18.2 37.9,18.2 37.67,17.97 32.77,17.97 U9.5
N$51
  Top 0.152: C8.2 38.96,19.16 38.4,18.6 32.77,18.6 U9.6
N$52
  Top 0.152: U2.P$2 28.6,11.47 28.6,16.6 27.71,17.49 U9.13
N$53
  Top 0.152: U2.P$3 30.1,10.23 30.1,18.8 31.29,19.99 U9.8
N$56
  Top 0.152: X17.2 27.62,78.37 U5.1 31.15,74.06 U3.1
N$57  (via drill 0.3)
  Top 0.152: v18.33,32.17 18.3,32.2 18.3,25.11 24.67,18.74 U9.11 | v18.4,35.5 18.4,42.13 M1.CN8-1
  Bottom 0.152: v18.33,32.17 18.33,35.43 v18.4,35.5
N$58
  Top 0.152: M1.CN8-2 24.74,41.06 30.4,35.4 30.4,25.57 25.48,20.65 25.48,20.29 U9.9
NOT_INVALID
  Top 0.152: M1.CN8-3 20.15,38.8 26.5,38.8 30.09,35.2 30.09,25.89 26.5,22.3 24.2,22.3 23.6,21.7 23.6,20.44 24.67,19.36 U9.10
OUT1
  Top 0.152: M1.CN5-3 62.92,57.82 60.9,55.8 60.9,30.4 56.54,26.04 R14.2 54.2,24.14 54.17,24.14 53.2,24.14 U19.2 52.4,23.3 54.7,21 54.7,18.4 P9.1
VCC  (via drill 0.3)
  Top 0.152: C13.1 40.46,67.34 v42.9,64.9 | v45.5,61.9 52.51,54.89 R25.2 R21.2 52.51,43.84 R22.2 52.61,43.64 R23.2 52.61,33.34 R24.2 44.91,33.19 P1.1 | U6.3 37.52,69.18 C13.1 | U3.2 34.58,67.01 C14.1 37.17,67.01 C12.1 37.58,67.34 C13.1
  Bottom 0.152: v45.5,61.9 45.5,62.3 v42.9,64.9
VIN
  Top 0.152: M1.CN7-24 M1.CN6-8

### Text on the board
tNames: USMApMonitor | BAGAMASA